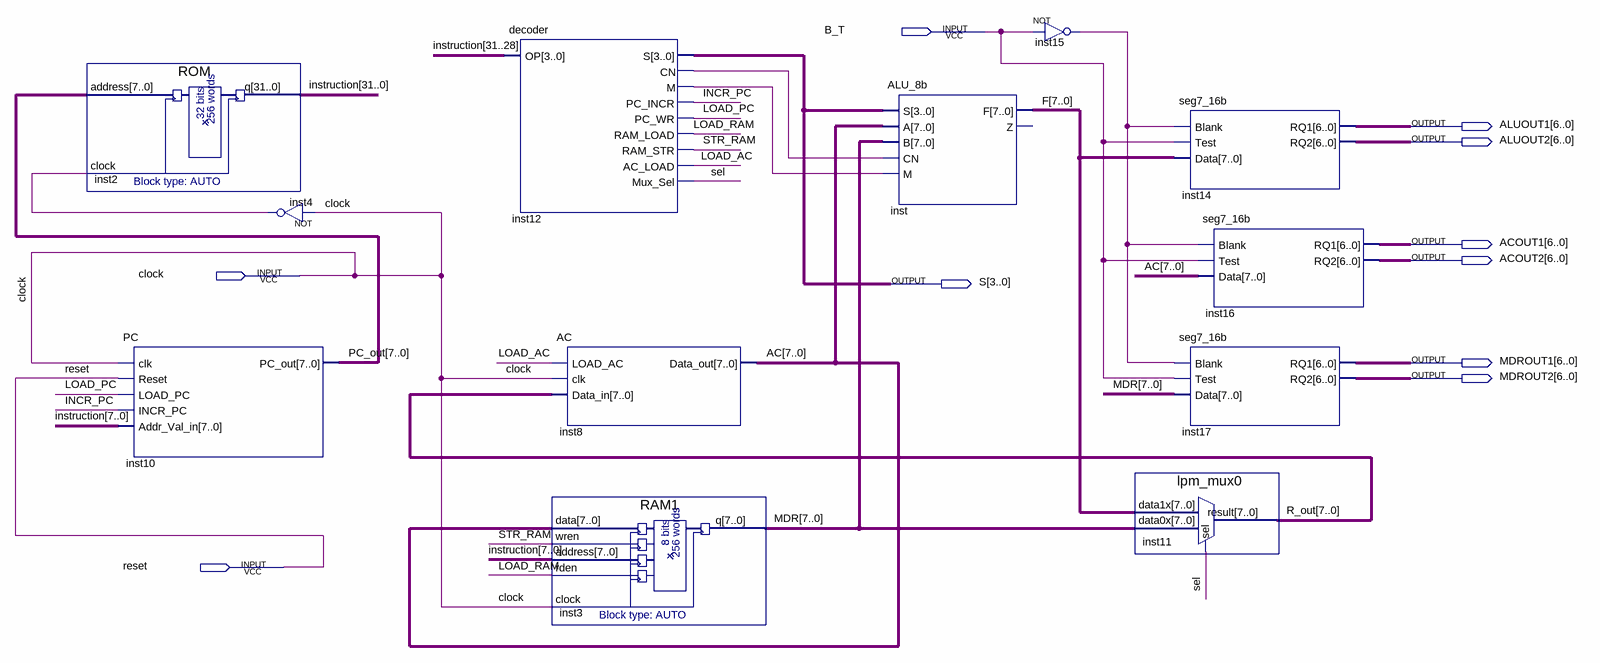
[diagram p0: schematic sheet]
// Quartus schematic controller.bdf as structural Verilog: 12 symbols, 10 pins
module controller (
  input  B_T,
  input  clock,
  input  reset,
  output [6:0] ALUOUT1,
  output [6:0] ALUOUT2,
  output [6:0] ACOUT1,
  output [6:0] ACOUT2,
  output [3:0] S,
  output [6:0] MDROUT1,
  output [6:0] MDROUT2
);

  wire INCR_PC, inst4_out, inst12_cn, inst12_m, inst15_out, LOAD_AC, LOAD_PC, LOAD_RAM, sel, STR_RAM;
  wire [7:0] AC, F, MDR, PC_out, R_out;
  wire [31:0] instruction;

  ROM inst2 (.address(PC_out), .clock(inst4_out), .q(instruction));
  PC inst10 (
    .clk(clock), .Reset(reset), .LOAD_PC(LOAD_PC), .INCR_PC(INCR_PC), .Addr_Val_in(instruction[7:0]),
    .PC_out(PC_out));
  not inst4 (inst4_out, clock);
  decoder inst12 (
    .OP(instruction[31:28]), .S(S), .CN(inst12_cn), .M(inst12_m), .PC_INCR(INCR_PC), .PC_WR(LOAD_PC),
    .RAM_LOAD(LOAD_RAM), .RAM_STR(STR_RAM), .AC_LOAD(LOAD_AC), .Mux_Sel(sel));
  AC inst8 (.LOAD_AC(LOAD_AC), .clk(clock), .Data_in(R_out), .Data_out(AC));
  RAM1 inst3 (.data(AC), .wren(STR_RAM), .address(instruction[7:0]), .rden(LOAD_RAM), .clock(clock), .q(MDR));
  ALU_8b inst (.S(S), .A(AC), .B(MDR), .CN(inst12_cn), .M(inst12_m), .F(F));  // open: Z
  not inst15 (inst15_out, B_T);
  lpm_mux0 inst11 (.data1x(F), .data0x(MDR), .sel(sel), .result(R_out));
  seg7_16b inst14 (.Blank(inst15_out), .Test(B_T), .Data(F), .RQ1(ALUOUT1), .RQ2(ALUOUT2));
  seg7_16b inst16 (.Blank(inst15_out), .Test(B_T), .Data(AC), .RQ1(ACOUT1), .RQ2(ACOUT2));
  seg7_16b inst17 (.Blank(inst15_out), .Test(B_T), .Data(MDR), .RQ1(MDROUT1), .RQ2(MDROUT2));
endmodule
